# Altium schematic sheet 2002_SchemaBloc.SchDoc
size A3; Author: Joao Marques Chaves; Organization: ETML-ES; Address1: Avenue Recordon 1; Address2: 1004 Lausanne; Address3: Switzerland; SheetNumber: 1; SheetTotal: 7; Version: C
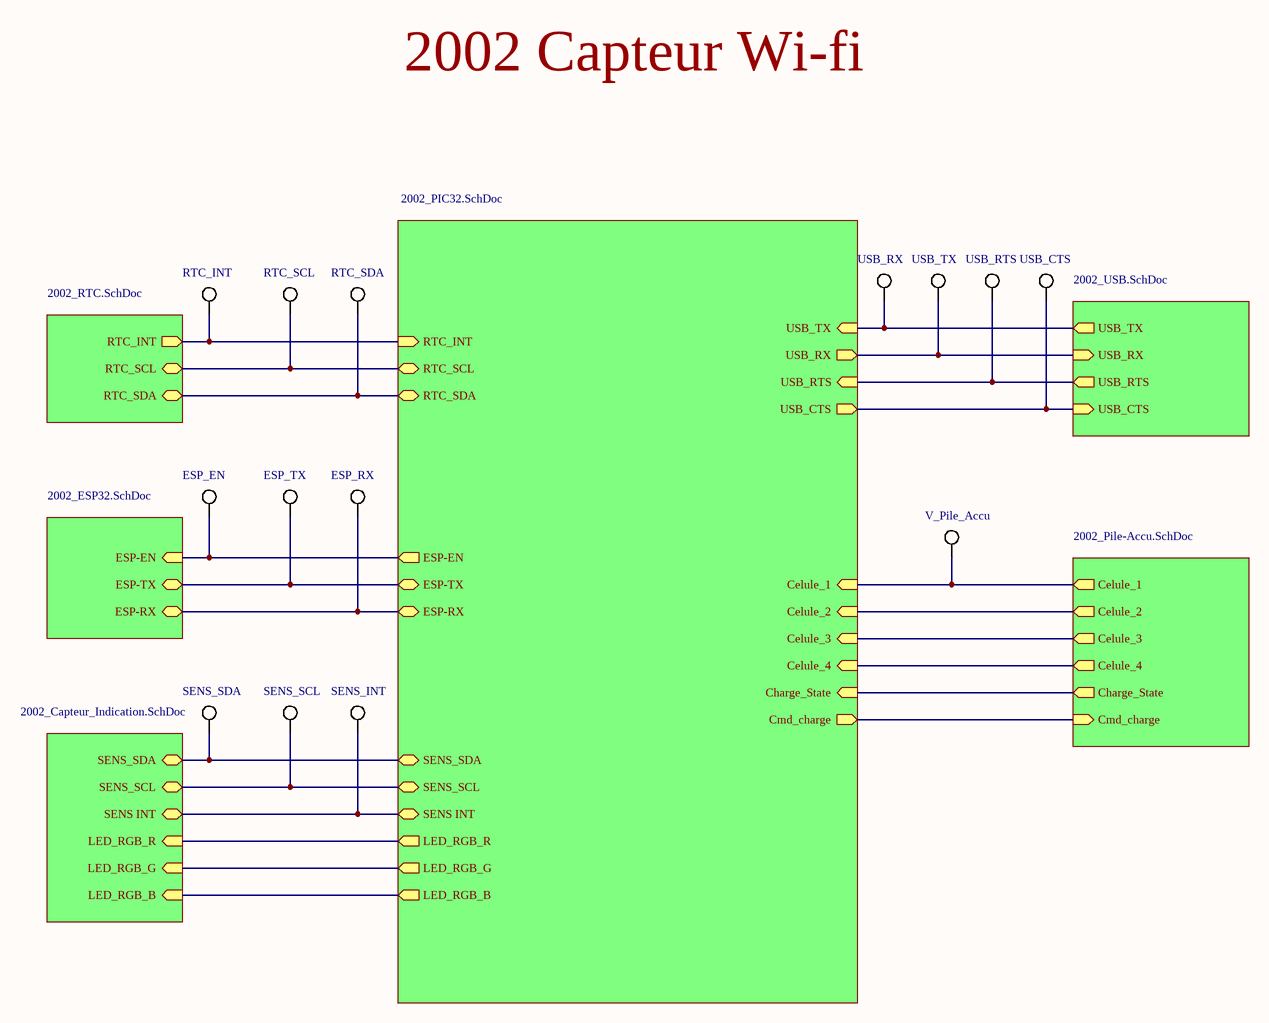
[diagram p0: 2002_SchemaBloc.SchDoc]

## Parts
ESP_EN  5019  [TESTPOINT_SMD]  (value not drawn)
ESP_RX  5019  [TESTPOINT_SMD]  (value not drawn)
ESP_TX  5019  [TESTPOINT_SMD]  (value not drawn)
RTC_INT  5019  [TESTPOINT_SMD]  (value not drawn)
RTC_SCL  5019  [TESTPOINT_SMD]  (value not drawn)
RTC_SDA  5019  [TESTPOINT_SMD]  (value not drawn)
SENS_INT  5019  [TESTPOINT_SMD]  (value not drawn)
SENS_SCL  5019  [TESTPOINT_SMD]  (value not drawn)
SENS_SDA  5019  [TESTPOINT_SMD]  (value not drawn)
USB_CTS  5019  [TESTPOINT_SMD]  (value not drawn)
USB_RTS  5019  [TESTPOINT_SMD]  (value not drawn)
USB_RX  5019  [TESTPOINT_SMD]  (value not drawn)
USB_TX  5019  [TESTPOINT_SMD]  (value not drawn)
V_Pile_Accu  5019  [TESTPOINT_SMD]  (value not drawn)

## Sub-sheets
Communication = 2002_Capteur_Indication.SchDoc: SENS_SDA (bidir), SENS_SCL (bidir), LED_RGB_R (in), LED_RGB_G (in), LED_RGB_B (in), SENS INT (bidir)
ESP32 = 2002_ESP32.SchDoc: ESP-RX (bidir), ESP-EN (in), ESP-TX (bidir)
Ethernet = 2002_RTC.SchDoc: RTC_SCL (bidir), RTC_SDA (bidir), RTC_INT (out)
Microcontrôleur = 2002_PIC32.SchDoc: RTC_SCL (bidir), RTC_SDA (bidir), ESP-EN (out), ESP-TX (bidir), ESP-RX (bidir), SENS_SDA (bidir), SENS_SCL (bidir), SENS INT (bidir), LED_RGB_R (out), LED_RGB_G (out), LED_RGB_B (out), USB_RX (out), USB_TX (in), USB_RTS (in), USB_CTS (out), Celule_1 (in), Celule_2 (in), Celule_3 (in), Celule_4 (in), RTC_INT (in), Charge_State (in), Cmd_charge (out)
Puissance = 2002_USB.SchDoc: USB_TX (out), USB_RX (in), USB_RTS (out), USB_CTS (in)
Puissance = 2002_Pile-Accu.SchDoc: Celule_1 (out), Celule_2 (out), Celule_3 (out), Celule_4 (out), Charge_State (out), Cmd_charge (in)

## Nets
NetESP_EN_1: ESP_EN.1 ; sheet Microcontrôleur/ESP-EN, sheet ESP32/ESP-EN
NetESP_RX_1: ESP_RX.1 ; sheet Microcontrôleur/ESP-RX, sheet ESP32/ESP-RX
NetESP_TX_1: ESP_TX.1 ; sheet Microcontrôleur/ESP-TX, sheet ESP32/ESP-TX
NetRTC_INT_1: RTC_INT.1 ; sheet Microcontrôleur/RTC_INT, sheet Ethernet/RTC_INT
NetRTC_SCL_1: RTC_SCL.1 ; sheet Microcontrôleur/RTC_SCL, sheet Ethernet/RTC_SCL
NetRTC_SDA_1: RTC_SDA.1 ; sheet Microcontrôleur/RTC_SDA, sheet Ethernet/RTC_SDA
NetSENS_INT_1: SENS_INT.1 ; sheet Microcontrôleur/SENS INT, sheet Communication/SENS INT
NetSENS_SCL_1: SENS_SCL.1 ; sheet Microcontrôleur/SENS_SCL, sheet Communication/SENS_SCL
NetSENS_SDA_1: SENS_SDA.1 ; sheet Microcontrôleur/SENS_SDA, sheet Communication/SENS_SDA
NetUSB_CTS_1: USB_CTS.1 ; sheet Puissance/USB_CTS, sheet Microcontrôleur/USB_CTS
NetUSB_RTS_1: USB_RTS.1 ; sheet Puissance/USB_RTS, sheet Microcontrôleur/USB_RTS
NetUSB_RX_1: USB_RX.1 ; sheet Puissance/USB_TX, sheet Microcontrôleur/USB_TX
NetUSB_TX_1: USB_TX.1 ; sheet Puissance/USB_RX, sheet Microcontrôleur/USB_RX
NetV_Pile_Accu_1: V_Pile_Accu.1 ; sheet Microcontrôleur/Celule_1, sheet Puissance/Celule_1
(unnamed): sheet Microcontrôleur/LED_RGB_R, sheet Communication/LED_RGB_R
(unnamed): sheet Microcontrôleur/LED_RGB_G, sheet Communication/LED_RGB_G
(unnamed): sheet Microcontrôleur/LED_RGB_B, sheet Communication/LED_RGB_B
(unnamed): sheet Microcontrôleur/Celule_2, sheet Puissance/Celule_2
(unnamed): sheet Microcontrôleur/Celule_3, sheet Puissance/Celule_3
(unnamed): sheet Microcontrôleur/Celule_4, sheet Puissance/Celule_4
(unnamed): sheet Microcontrôleur/Charge_State, sheet Puissance/Charge_State
(unnamed): sheet Microcontrôleur/Cmd_charge, sheet Puissance/Cmd_charge

## Notes on the sheet
- 2002 Capteur Wi-fi
- Fichier :
- a
- Date :
- Heure :
- Version :
- Auteur :
- Modif.
- b
- c
- d
- Projet :
- No :
- Nb feuilles
- Feuille n°
- Chemin :

## Library data of the parts
ESP_EN ESP_RX ESP_TX RTC_INT RTC_SCL RTC_SDA SENS_INT SENS_SCL SENS_SDA USB_CTS USB_RTS USB_RX USB_TX V_Pile_Accu = TESTPOINT: Test point smd